# Altium schematic sheet Main.SchDoc
size 218 x 194 mm
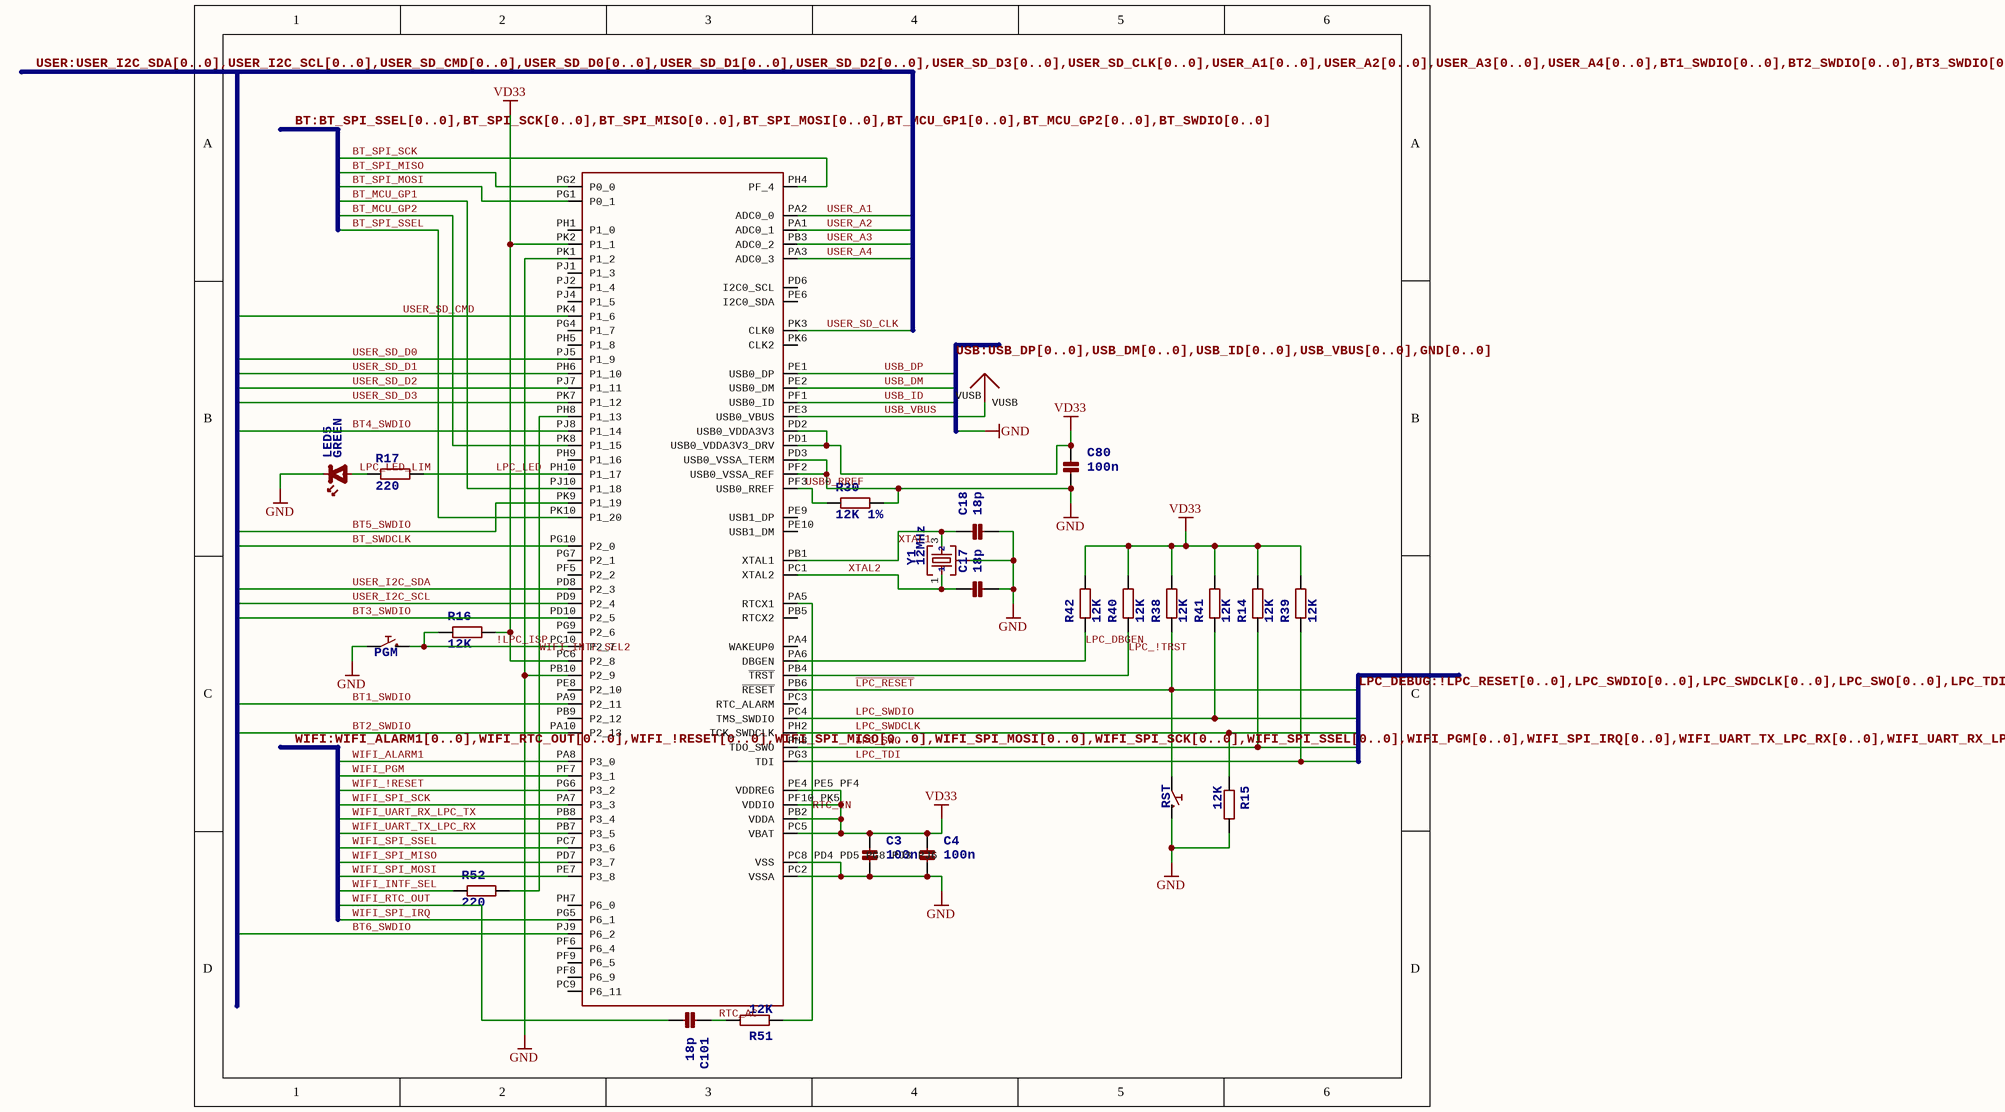
[diagram p0: Main.SchDoc]

## Parts
C3  100n  [0402]
C4  100n  [0402]
C17  18p  [0402]
C18  18p  [0402]
C80  100n  [0402]
C101  18p  [0402]
LED5  GREEN  [0402_POLAR]
MCU1  LPC1837JET100TFBGA100(JET100)  [BGA100-0.8]  (value not drawn)
PGM  PUSHBUTTONKMR2XX  [CK-KMR2]  (value not drawn)
R14  12K  [0402]
R15  12K  [0402]
R16  12K  [0402]
R17  220  [0402]
R30  12K 1%  [0402]
R38  12K  [0402]
R39  12K  [0402]
R40  12K  [0402]
R41  12K  [0402]
R42  12K  [0402]
R51  12K  [0402]
R52  220  [0402]
RST  PUSHBUTTONKMR2XX  [CK-KMR2]  (value not drawn)
U$31  VUSB  (value not drawn)
Y1  12MHz  [ABM8G]

## Nets
GND: C3.P$2 C4.P$2 C17.P$2 C18.P$2 C80.P$2 LED5.K(CATHODE) MCU1.PB10(P2_9) MCU1.PC2(VSSA) MCU1.PC8_PD4_PD5_PG8_PJ3_PJ6(VSS) MCU1.PD3(USB0_VSSA_TERM) MCU1.PF2(USB0_VSSA_REF) MCU1.PK1(P1_2) PGM.P$1_P$2 R15.P$2 R30.P$2 RST.P$3_P$4 Y1.2_4(GND)
VD33: C3.P$1 C4.P$1 C80.P$1 MCU1.PB2(VDDA) MCU1.PC5(VBAT) MCU1.PC6(P2_8) MCU1.PD1(USB0_VDDA3V3_DRV) MCU1.PD2(USB0_VDDA3V3) MCU1.PE4_PE5_PF4(VDDREG) MCU1.PF10_PK5(VDDIO) MCU1.PK2(P1_1) R14.P$2 R16.P$2 R38.P$2 R39.P$2 R40.P$2 R41.P$2 R42.P$2
!LPC_ISP: MCU1.PC10(P2_7) PGM.P$3_P$4 R16.P$1
BT1_SWDIO: MCU1.PA9(P2_11)
BT2_SWDIO: MCU1.PA10(P2_13)
BT3_SWDIO: MCU1.PD10(P2_5)
BT4_SWDIO: MCU1.PJ8(P1_14)
BT5_SWDIO: MCU1.PK9(P1_19)
BT6_SWDIO: MCU1.PJ9(P6_2)
BT_MCU_GP1: MCU1.PJ10(P1_18)
BT_MCU_GP2: MCU1.PK8(P1_15)
BT_SPI_MISO: MCU1.PG2(P0_0)
BT_SPI_MOSI: MCU1.PG1(P0_1)
BT_SPI_SCK: MCU1.PH4(PF_4)
BT_SPI_SSEL: MCU1.PK10(P1_20)
BT_SWDCLK: MCU1.PG10(P2_0)
~{LPC_RESET}: MCU1.PB6(~{RESET}) R38.P$1 RST.P$1_P$2  [also labelled LPC_DEBUG:!LPC_RESET[0..0],LPC_SWDIO[0..0],LPC_SWDCLK[0..0],LPC_SWO[0..0],LPC_TDI[0..0]]
LPC_!TRST: MCU1.PB4(~{TRST}) R40.P$1
LPC_DBGEN: MCU1.PA6(DBGEN) R42.P$1
LPC_LED: MCU1.PH10(P1_17) R17.P$2
LPC_LED_LIM: LED5.A(ANODE) R17.P$1
LPC_SWDCLK: MCU1.PH2(TCK_SWDCLK) R15.P$1
LPC_SWDIO: MCU1.PC4(TMS_SWDIO) R41.P$1
LPC_SWO: MCU1.PH3(TDO_SWO) R14.P$1
LPC_TDI: MCU1.PG3(TDI) R39.P$1
RTC_AC: C101.P$1 R51.P$2
RTC_IN: MCU1.PA5(RTCX1) R51.P$1
USB0_RREF: MCU1.PF3(USB0_RREF) R30.P$1
USB_DM: MCU1.PE2(USB0_DM)
USB_DP: MCU1.PE1(USB0_DP)
USB_ID: MCU1.PF1(USB0_ID)
USB_VBUS: MCU1.PE3(USB0_VBUS) U$31.VUSB
USER_A1: MCU1.PA2(ADC0_0)
USER_A2: MCU1.PA1(ADC0_1)
USER_A3: MCU1.PB3(ADC0_2)
USER_A4: MCU1.PA3(ADC0_3)
USER_I2C_SCL: MCU1.PD9(P2_4)
USER_I2C_SDA: MCU1.PD8(P2_3)
USER_SD_CLK: MCU1.PK3(CLK0)
USER_SD_CMD: MCU1.PK4(P1_6)
USER_SD_D0: MCU1.PJ5(P1_9)
USER_SD_D1: MCU1.PH6(P1_10)
USER_SD_D2: MCU1.PJ7(P1_11)
USER_SD_D3: MCU1.PK7(P1_12)
WIFI_!RESET: MCU1.PG6(P3_2)
WIFI_ALARM1: MCU1.PA8(P3_0)
WIFI_INTF_SEL: R52.P$1
WIFI_INTF_SEL2: MCU1.PH8(P1_13) R52.P$2
WIFI_PGM: MCU1.PF7(P3_1)
WIFI_RTC_OUT: C101.P$2
WIFI_SPI_IRQ: MCU1.PG5(P6_1)
WIFI_SPI_MISO: MCU1.PD7(P3_7)
WIFI_SPI_MOSI: MCU1.PE7(P3_8)
WIFI_SPI_SCK: MCU1.PA7(P3_3)
WIFI_SPI_SSEL: MCU1.PC7(P3_6)
WIFI_UART_RX_LPC_TX: MCU1.PB8(P3_4)
WIFI_UART_TX_LPC_RX: MCU1.PB7(P3_5)
XTAL1: C18.P$1 MCU1.PB1(XTAL1) Y1.3
XTAL2: C17.P$1 MCU1.PC1(XTAL2) Y1.1

Not connected (* = marked no-connect by the designer): MCU1 PA4(WAKEUP0) PB5(RTCX2) PB9(P2_12) PC3(RTC_ALARM) PC9(P6_11) PD6(I2C0_SCL) PE6(I2C0_SDA) PE8(P2_10) PE9(USB1_DP) PE10(USB1_DM) PF5(P2_2) PF6(P6_4) PF8(P6_9) PF9(P6_5) PG4(P1_7) PG7(P2_1) PG9(P2_6) PH1(P1_0) PH5(P1_8) PH7(P6_0) PH9(P1_16) PJ1(P1_3) PJ2(P1_4) PJ4(P1_5) PK6(CLK2)

## Buses and harness runs
bus BT:BT_SPI_SSEL[0..0],BT_SPI_SCK[0..0],BT_SPI_MISO[0..0],BT_SPI_MOSI[0..0],BT_MCU_GP1[0..0],BT_MCU_GP2[0..0],BT_SWDIO[0..0]
bus USB:USB_DP[0..0],USB_DM[0..0],USB_ID[0..0],USB_VBUS[0..0],GND[0..0]
bus USER:USER_I2C_SDA[0..0],USER_I2C_SCL[0..0],USER_SD_CMD[0..0],USER_SD_D0[0..0],USER_SD_D1[0..0],USER_SD_D2[0..0],USER_SD_D3[0..0],USER_SD_CLK[0..0],USER_A1[0..0],USER_A2[0..0],USER_A3[0..0],USER_A4[0..0],BT1_SWDIO[0..0],BT2_SWDIO[0..0],BT3_SWDIO[0..0],BT4_SWDIO[0..0],BT5_SWDIO[0..0],BT6_SWDIO[0..0],BT_SWDCLK[0..0],USER_GP1[0..0]
bus WIFI:WIFI_ALARM1[0..0],WIFI_RTC_OUT[0..0],WIFI_!RESET[0..0],WIFI_SPI_MISO[0..0],WIFI_SPI_MOSI[0..0],WIFI_SPI_SCK[0..0],WIFI_SPI_SSEL[0..0],WIFI_PGM[0..0],WIFI_SPI_IRQ[0..0],WIFI_UART_TX_LPC_RX[0..0],WIFI_UART_RX_LPC_TX[0..0],WIFI_INTF_SEL[0..0]

## Library data of the parts
C3 C4 C17 C18 C80 C101 = CAP_CERAMIC0402: <p><b>Ceramic Capacitors</b></p> / <b>0603</b> - 0603 Surface Mount Capacitors / <ul> / <li>3pF 250V +/-0.1pF RF Ceramic Capacitor[Digikey: 712-1347-1-ND]</li> / <li>16 pF 50V 5% Ceramic Capacitor[Digikey: 445-5051-2-ND]</li> / <li>18 pF 250V 5% RF Ceramic Capcitor [Digikey: 478-3505-1-ND]</li> / <li>22 pF 50V Ceramic Capacitor [Digikey: PCC220ACVTR-ND]</li> / <li>33 pF 50V 5% Ceramic Capacitor</li> / <li>56 pF 250V 5% C0G RF Ceramic Capcitor [Digikey: 490-4867-1-ND]</li> / <li>680 pF 50V Ceramic Capacitor</li> / <li>2200 pF 50V 5% C0G Ceramic Capacitor [Digikey: 445-1297-1-ND]</li> / <li>5600 pF 100V 5% X7R Ceramic Capacitor [Digikey: 478-3711-1-ND]</li> / <li>0.1 µF 25V 10% Ceramic Capacitor [Digikey: PCC2277TR-ND]</li> / <li>0.22 µF 16V 10% X7R Ceramic Capacitor [Digikey: 445-1318-1-ND]</li> / <li>1.0 µF 25V 10% Ceramic Capacitor [Digikey: 445-5146-2-ND]</li> / </ul> / <b>0805</b> - 0805 Surface Mount Capacitors / <ul> / <li>220 pF 250V 2% RF Ceramic Capacitor [Digikey: 712-1398-1-ND]</li> / <li>1000 pF 50V 2% NP0 Ceramic Capacitor [Digikey: 478-3760-1-ND]</li> / <li>0.1 µF 25V 10% Ceramic Capacitor [Digikey: PCC1828TR-ND]</li> / <li>1.0 µF 16V 10% Ceramic Capacitor[Digikey: 490-1691-2-ND]</li> / <li>10.0 µF 10V 10% Ceramic Capacitor[Digikey: 709-1228-1-ND]</li> / </ul> / </ul><b>1206</b> - 1206 Surface Mount Capacitors
LED5 = LED0402: LED common
PGM RST = PUSHBUTTONKMR2XX: <p><b>Push button</b> 1 x momentary close switches</p>
R14-R17 R30 R38-R42 R51 R52 = R-EU_0402: <B>RESISTOR</B>, European symbol
U$31 = VUSB: "USB Power"
Y1 = CRYSTAL_WITH_GROUNDABM8G: 1: 1; 2: 2